# Altium schematic sheet IO.SchDoc
size A3; SheetNumber: 2; SheetTotal: 2
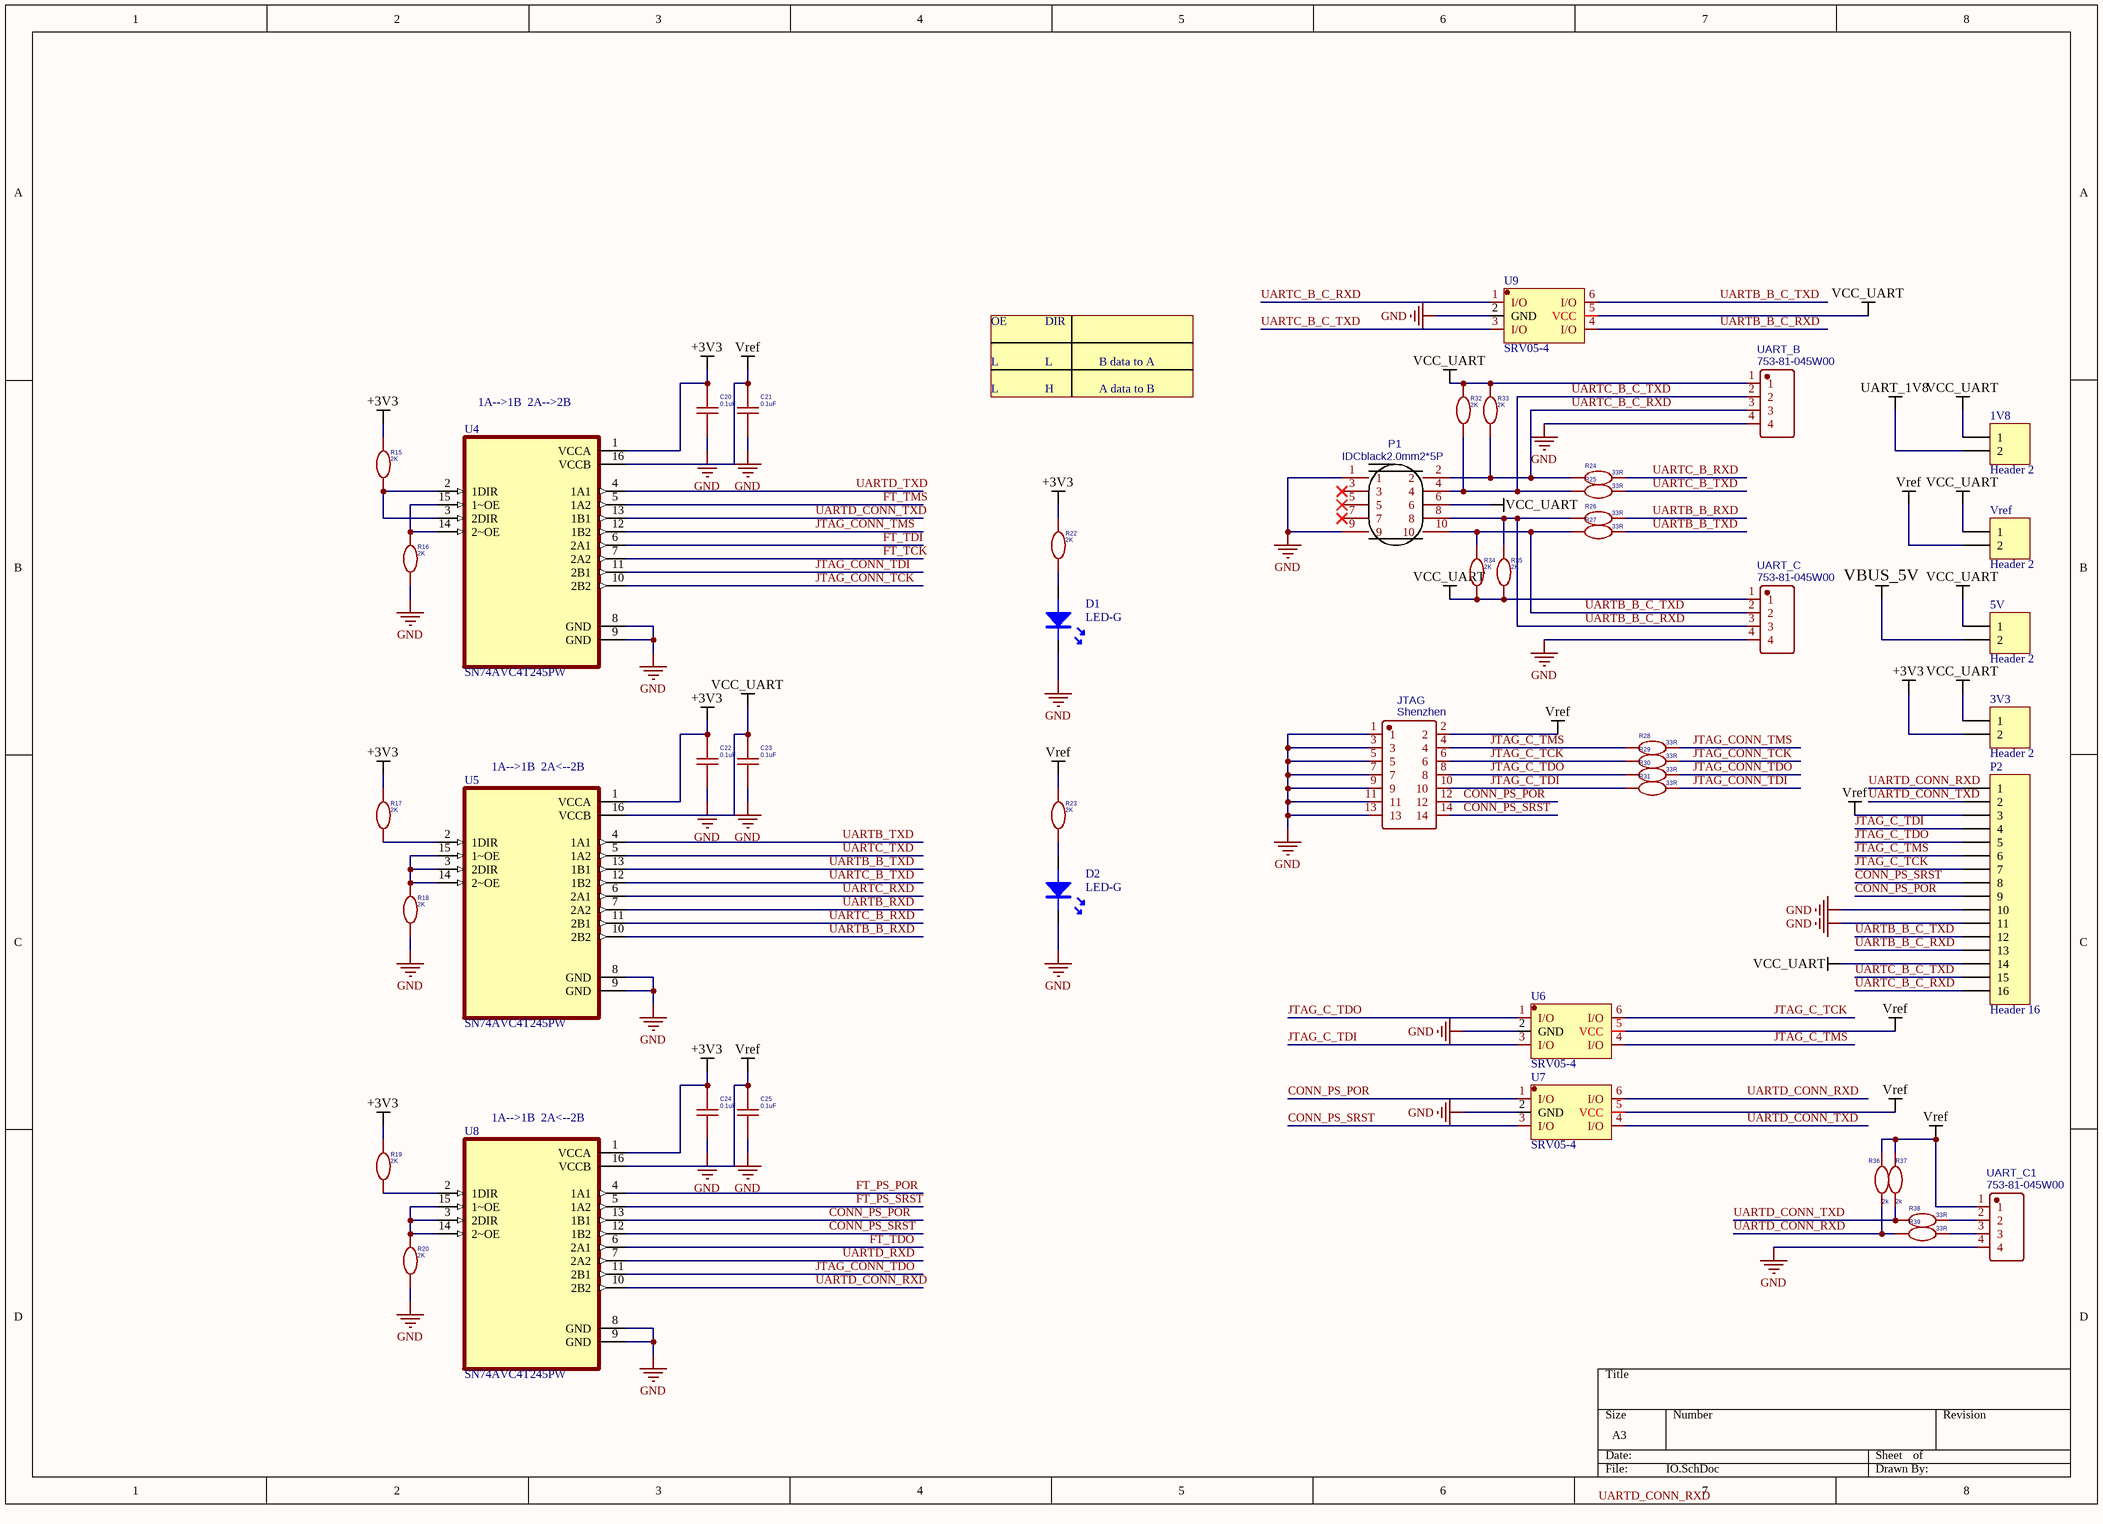
[diagram p0: IO.SchDoc]

## Parts
1V8  Header 2  [HDR1X2]
3V3  Header 2  [HDR1X2]
5V  Header 2  [HDR1X2]
C20  0.1uF  [0603C]
C21  0.1uF  [0603C]
C22  0.1uF  [0603C]
C23  0.1uF  [0603C]
C24  0.1uF  [0603C]
C25  0.1uF  [0603C]
D1  LED-G  [LED-0603G]
D2  LED-G  [LED-0603G]
JTAG  Shenzhen  [IDC-TH_14P-P2.00_B-3002R14P-0110]
P1  IDCblack2.0mm2*5P  [IDC-TH_10P-P2.00-C33049]
P2  Header 16  [HDR1X16]
R15  2K  [0603R]
R16  2K  [0603R]
R17  2K  [0603R]
R18  2K  [0603R]
R19  2K  [0603R]
R20  2K  [0603R]
R22  2K  [0603R]
R23  2K  [0603R]
R24  33R  [0603R]
R25  33R  [0603R]
R26  33R  [0603R]
R27  33R  [0603R]
R28  33R  [0603R]
R29  33R  [0603R]
R30  33R  [0603R]
R31  33R  [0603R]
R32  2K  [0603R]
R33  2K  [0603R]
R34  2K  [0603R]
R35  2K  [0603R]
R36  2k  [0603R]
R37  2k  [0603R]
R38  33R  [0603R]
R39  33R  [0603R]
U4  SN74AVC4T245PW  [SOP65P640X120-16N]
U5  SN74AVC4T245PW  [SOP65P640X120-16N]
U6  SRV05-4  [SOT23-6]
U7  SRV05-4  [SOT23-6]
U8  SN74AVC4T245PW  [SOP65P640X120-16N]
U9  SRV05-4  [SOT23-6]
UART_B  753-81-045W00  [CONN-TH_4P-P2.50-V-M_753]
UART_C  753-81-045W00  [CONN-TH_4P-P2.50-V-M_753]
UART_C1  753-81-045W00  [CONN-TH_4P-P2.50-V-M_753]
Vref  Header 2  [HDR1X2]

## Nets
+3V3: 3V3.2 C20.2 C22.2 C24.2 R15.2 R17.2 R19.2 R22.2 U4.1(VCCA) U5.1(VCCA) U8.1(VCCA)
GND: C20.1 C21.1 C22.1 C23.1 C24.1 C25.1 D1.K D2.K JTAG.1 JTAG.3 JTAG.5 JTAG.7 JTAG.9 JTAG.11 JTAG.13 P1.1 P1.9 P2.10 P2.11 R16.1 R18.1 R20.1 U4.8(GND) U4.9(GND) U5.8(GND) U5.9(GND) U6.2(GND) U7.2(GND) U8.8(GND) U8.9(GND) U9.2(GND) UART_B.4 UART_C.4 UART_C1.4
UART_1V8: 1V8.2
VBUS_5V: 5V.2
VCC_UART: 1V8.1 3V3.1 5V.1 C23.2 P1.6 P2.14 R32.2 R33.2 R34.1 R35.1 U5.16(VCCB) U9.5(VCC) UART_B.1 UART_C.1 Vref.1
Vref: C21.2 C25.2 JTAG.2 P2.3 R23.2 R36.1 R37.1 U4.16(VCCB) U6.5(VCC) U7.5(VCC) U8.16(VCCB) UART_C1.1 Vref.2
CONN_PS_POR: JTAG.12 P2.9 U7.1(I/O) U8.13(1B1)
CONN_PS_SRST: JTAG.14 P2.8 U7.3(I/O) U8.12(1B2)
FT_PS_POR: U8.4(1A1)
FT_PS_SRST: U8.5(1A2)
FT_TCK: U4.7(2A2)
FT_TDI: U4.6(2A1)
FT_TDO: U8.6(2A1)
FT_TMS: U4.5(1A2)
JTAG_C_TCK: JTAG.6 P2.7 R29.2 U6.6(I/O)
JTAG_C_TDI: JTAG.10 P2.4 R31.2 U6.3(I/O)
JTAG_C_TDO: JTAG.8 P2.5 R30.2 U6.1(I/O)
JTAG_C_TMS: JTAG.4 P2.6 R28.2 U6.4(I/O)
JTAG_CONN_TCK: R29.1 U4.10(2B2)
JTAG_CONN_TDI: R31.1 U4.11(2B1)
JTAG_CONN_TDO: R30.1 U8.11(2B1)
JTAG_CONN_TMS: R28.1 U4.12(1B2)
UARTB_B_C_RXD: P1.8 P2.13 R26.2 R35.2 U9.4(I/O) UART_C.3
UARTB_B_C_TXD: P1.10 P2.12 R27.2 R34.2 U9.6(I/O) UART_C.2
UARTB_B_RXD: R26.1 U5.10(2B2)
UARTB_B_TXD: R27.1 U5.13(1B1)
UARTB_RXD: U5.7(2A2)
UARTB_TXD: U5.4(1A1)
UARTC_B_C_RXD: P1.2 P2.16 R24.2 R33.1 U9.1(I/O) UART_B.3
UARTC_B_C_TXD: P1.4 P2.15 R25.2 R32.1 U9.3(I/O) UART_B.2
UARTC_B_RXD: R24.1 U5.11(2B1)
UARTC_B_TXD: R25.1 U5.12(1B2)
UARTC_RXD: U5.6(2A1)
UARTC_TXD: U5.5(1A2)
UARTD_CONN_RXD: P2.1 R36.2 R39.2 U7.6(I/O) U8.10(2B2)
UARTD_CONN_TXD: P2.2 R37.2 R38.2 U4.13(1B1) U7.4(I/O)
UARTD_RXD: U8.7(2A2)
UARTD_TXD: U4.4(1A1)
NetD1_A: D1.A R22.1
NetD2_A: D2.A R23.1
NetR15_1: R15.1 U4.2(1DIR) U4.3(2DIR)
NetR16_2: R16.2 U4.14(2~OE) U4.15(1~OE)
NetR17_1: R17.1 U5.2(1DIR)
NetR18_2: R18.2 U5.3(2DIR) U5.14(2~OE) U5.15(1~OE)
NetR19_1: R19.1 U8.2(1DIR)
NetR20_2: R20.2 U8.3(2DIR) U8.14(2~OE) U8.15(1~OE)
NetR38_1: R38.1 UART_C1.2
NetR39_1: R39.1 UART_C1.3

Not connected (* = marked no-connect by the designer): P1 3* 5* 7*

## Notes on the sheet
- OE
- L
- DIR
- B data to A
- (near U4) 1A-->1B  2A-->2B
- H
- A data to B
- (near U5) 1A-->1B  2A<--2B
- (near U8) 1A-->1B  2A<--2B
- Labels drawn without touching a wire or pin: UARTD_CONN_RXD

## Library data of the parts
1V8 3V3 5V Vref = Header 2: Header, 2-Pin; LatestRevisionDate: 17-Jul-2002; LatestRevisionNote: Re-released for DXP Platform.; Publisher: Altium Limited
C20-C25 = 104: nameAlias: Value(F); Contributor: LCEDA_Lib; spicePre: C; spiceSymbolName: C_0603_US
D1 D2 = LED
JTAG = Shenzhen: BOM_Manufacturer: Shenzhen Cankemeng; BOM_Manufacturer Part: B-3002R14P-0110; nameAlias: Value; Contributor: LCSC; BOM_Supplier: LCSC; BOM_Supplier Part: C383616; BOM_JLCPCB Part Class: Extended Part; spicePre: C; spiceSymbolName: B-3002R14P-0110
P1 = IDCblack2.0mm2*5P: BOM_Manufacturer: BOOMELE(博穆精密); BOM_Manufacturer Part: 2.0-2*5P弯简牛; BOM_Supplier: LCSC; BOM_Supplier Part: C33049; BOM_JLCPCB Part Class: Extended Part; spicePre: P; spiceSymbolName: IDCblack2.0mm2*5P
P2 = Header 16: Header, 16-Pin; LatestRevisionDate: 17-Jul-2002; LatestRevisionNote: Re-released for DXP Platform.; Publisher: Altium Limited
R15-R20 R22-R39 = 10K: nameAlias: Value(Ω); Contributor: LCEDA_Lib; spicePre: R; spiceSymbolName: R_0603_EU
U4 U5 U8 = SN74AVC4T245PW: 4-Bit Dual-Supply Bus Transceiver with Configurable Voltage-Level Shifting and 3-State Outputs 16-TSSOP -40 to 85; MF: Texas Instruments; Price: None; Value: *; Texas_Instruments-Purchase-URL: https://snapeda.com/shop?store=Texas+Instruments&id=235694; Package: TSSOP-16 Texas Instruments; Mouser-Purchase-URL: https://snapeda.com/shop?store=Mouser&id=235694; Availability: Good; SnapEDA_Link: https://www.snapeda.com/parts/SN74AVC4T245PW/Texas%20Instruments/view-part/235694/?ref=snap; MP: SN74AVC4T245PW; DigiKey-Purchase-URL: https://snapeda.com/shop?store=DigiKey&id=235694; Check_prices: https://www.snapeda.com/parts/SN74AVC4T245PW/Texas%20Instruments/view-part/235694/?ref=eda
UART_B UART_C UART_C1 = 753-81-045W00: BOM_Manufacturer: PINREX(频锐科技); Contributor: LCSC; BOM_Supplier: LCSC; BOM_Supplier Part: C402792; BOM_Manufacturer Part: 753-81-045W00; BOM_JLCPCB Part Class: Extended Part; spicePre: C; spiceSymbolName: 753-81-045W00